# Altium schematic sheet CTR_MCU_Power.SchDoc: TMS320 Power
size A4; DrawnBy: Andrei Divinagracia; Revision: 0A; SheetNumber: 5; SheetTotal: 10
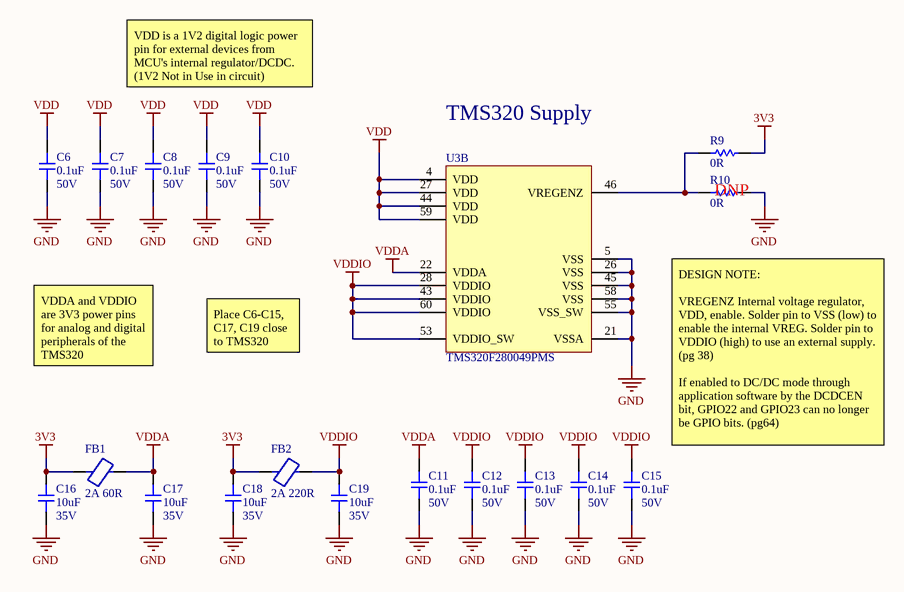
[diagram p0: CTR_MCU_Power.SchDoc]

## Parts
C6  Capacitance: 0.1uF  Voltage Rating: 50V  [CAP-0603]  (hidden comment: 0603-0.1uF-50V)
C7  Capacitance: 0.1uF  Voltage Rating: 50V  [CAP-0603]  (hidden comment: 0603-0.1uF-50V)
C8  Capacitance: 0.1uF  Voltage Rating: 50V  [CAP-0603]  (hidden comment: 0603-0.1uF-50V)
C9  Capacitance: 0.1uF  Voltage Rating: 50V  [CAP-0603]  (hidden comment: 0603-0.1uF-50V)
C10  Capacitance: 0.1uF  Voltage Rating: 50V  [CAP-0603]  (hidden comment: 0603-0.1uF-50V)
C11  Capacitance: 0.1uF  Voltage Rating: 50V  [CAP-0603]  (hidden comment: 0603-0.1uF-50V)
C12  Capacitance: 0.1uF  Voltage Rating: 50V  [CAP-0603]  (hidden comment: 0603-0.1uF-50V)
C13  Capacitance: 0.1uF  Voltage Rating: 50V  [CAP-0603]  (hidden comment: 0603-0.1uF-50V)
C14  Capacitance: 0.1uF  Voltage Rating: 50V  [CAP-0603]  (hidden comment: 0603-0.1uF-50V)
C15  Capacitance: 0.1uF  Voltage Rating: 50V  [CAP-0603]  (hidden comment: 0603-0.1uF-50V)
C16  Capacitance: 10uF  Voltage Rating: 35V  [CAP-0603]  (hidden comment: 0603-10uF-35V)
C17  Capacitance: 10uF  Voltage Rating: 35V  [CAP-0603]  (hidden comment: 0603-10uF-35V)
C18  Capacitance: 10uF  Voltage Rating: 35V  [CAP-0603]  (hidden comment: 0603-10uF-35V)
C19  Capacitance: 10uF  Voltage Rating: 35V  [CAP-0603]  (hidden comment: 0603-10uF-35V)
FB1  2A 60R  [FB-0805]
FB2  2A 220R  [FB-0805]
R9  0R  [RES-0603]
R10  0R  [RES-0603]
U3  TMS320F280049PMS  [64QFP]  (part B of 5)

## Nets
3V3: C16.2 C18.2 FB1.1 FB2.1 R9.2
GND: C6.1 C7.1 C8.1 C9.1 C10.1 C11.1 C12.1 C13.1 C14.1 C15.1 C16.1 C17.1 C18.1 C19.1 R10.2 U3.5(VSS) U3.21(VSSA) U3.26(VSS) U3.45(VSS) U3.55(VSS_SW) U3.58(VSS)
VDD: C6.2 C7.2 C8.2 C9.2 C10.2 U3.4(VDD) U3.27(VDD) U3.44(VDD) U3.59(VDD)
VDDA: C11.2 C17.2 FB1.2 U3.22(VDDA)
VDDIO: C12.2 C13.2 C14.2 C15.2 C19.2 FB2.2 U3.28(VDDIO) U3.43(VDDIO) U3.53(VDDIO_SW) U3.60(VDDIO)
NetR9_1: R9.1 R10.1 U3.46(VREGENZ)

## Notes on the sheet
- VDD is a 1V2 digital logic power pin for external devices from MCU's internal regulator/DCDC.
  (1V2 Not in Use in circuit)
- (near U3) TMS320 Supply
- (near R10) DNP
- VDDA and VDDIO are 3V3 power pins for analog and digital peripherals of the TMS320
- Place C6-C15, C17, C19 close to TMS320
- DESIGN NOTE:
  VREGENZ Internal voltage regulator, VDD, enable. Solder pin to VSS (low) to enable the internal VREG. Solder pin to VDDIO (high) to use an external supply. (pg 38)
  If enabled to DC/DC mode through application software by the DCDCEN bit, GPIO22 and GPIO23 can no longer be GPIO bits. (pg64)

## Library data of the parts
C6-C15 = 0603-0.1uF-50V: CAP CER 0.1UF 50V X7R 0603; Manufacturer: Kyocera AVX; Manufacturer Part Number: 06035C104JAT4A; Supplier 1: Digi-Key; Stock 1: 71529; Pricing 1: 1=0.1, 10=0.07, 50=0.0382, 100=0.0313, 500=0.02234, 1000=0.01755, 2500=0.01596, 5000=0.01468 (USD); RoHS Compliant: Yes; ComponentLink1URL: http://datasheets.avx.com/X7RDielectric.pdf?src-supplier=Digi-Key; ComponentLink1Description: http://datasheets.avx.com/X7RDielectric.pdf?src-supplier=Digi-Key; Supplier Part Number 1: 478-12459-1-ND
C16-C19 = 0603-10uF-35V: CAP CER 10UF 35V X5R 0603; Manufacturer: Murata; Manufacturer Part Number: GRM188R6YA106MA73D; Tolerance: 20%; Supplier 1: Digi-Key; Stock 1: 133; Pricing 1: 1=0.45, 10=0.315, 50=0.2202, 100=0.1887, 500=0.14154, 1000=0.11952 (USD); Mount: Surface Mount; Case/Package: 0603; Case Code (Metric): 1608; Case Code (Imperial): 0603; Min Operating Temperature: -55°C; Max Operating Temperature: 85°C; Packaging: Tape and Reel; Voltage Rating (DC): 35V; Dielectric: X5R; Length: 0.063inch; Width: 0.031inch; Thickness: 0.039inch; RoHS Compliant: Yes; ComponentLink1URL: http://search.murata.co.jp/Ceramy/image/img/A01X/G101/ENG/GRM188R6YA106MA73-01.pdf?src-supplier=Future+Electronics; ComponentLink1Description: http://search.murata.co.jp/Ceramy/image/img/A01X/G101/ENG/GRM188R6YA106MA73-01.pdf?src-supplier=Future+Electronics; ComponentLink2URL: http://search.murata.co.jp/Ceramy/image/img/A01X/G101/ENG/GRM188R6YA106MA73-01.pdf?src-supplier=Digi-Key; ComponentLink2Description: http://search.murata.co.jp/Ceramy/image/img/A01X/G101/ENG/GRM188R6YA106MA73-01.pdf?src-supplier=Digi-Key; ComponentLink3URL: https://www.murata.com/~/media/webrenewal/support/library/catalog/products/capacitor/mlcc/c02e.ashx?la=en-us&src-supplier=Digi-Key; ComponentLink3Description: https://www.murata.com/~/media/webrenewal/support/library/catalog/products/capacitor/mlcc/c02e.ashx?la=en-us&src-supplier=Digi-Key; ComponentLink4URL: http://search.murata.co.jp/Ceramy/image/img/A01X/G101/ENG/GRM188R6YA106MA73-01.pdf?src-supplier=Mouser; ComponentLink4Description: http://search.murata.co.jp/Ceramy/image/img/A01X/G101/ENG/GRM188R6YA106MA73-01.pdf?src-supplier=Mouser; ComponentLink5URL: http://search.murata.co.jp/Ceramy/image/img/A01X/G101/ENG/GRM188R6YA106MA73-01.pdf?src-supplier=TTI; ComponentLink5Description: http://search.murata.co.jp/Ceramy/image/img/A01X/G101/ENG/GRM188R6YA106MA73-01.pdf?src-supplier=TTI; Supplier Part Number 1: 490-13248-1-ND
FB1 = BKP2125HS600-T: FERRITE BEAD 60 OHM 0805 1LN; Manufacturer: Taiyo Yuden; Tolerance: 25%; Resistance: 25mR; Max Current Rating: 3A; Number of Lines: 1; Test Frequency: 100MHz; Shielding: Unshielded; Supplier 1: Digi-Key; Manufacturer Part Number: BKP2125HS600-T; Stock 1: 471; Pricing 1: 1=0.11, 10=0.086, 25=0.0768, 50=0.0564, 100=0.0487, 250=0.03848 (USD); Mount: Surface Mount; Case/Package: 0805; Number of Pins: 2; Core Material: Ferrite; Case Code (Metric): 2125; Case Code (Imperial): 0805; Min Operating Temperature: -55°C; Max Operating Temperature: 85°C; Packaging: Tape and Reel; Impedance: 60R; Package Quantity: 1; DC Resistance (DCR): 25mR; Max DC Current: 3A; Termination: SMD/SMT; Series: BK; Length: 2.3mm; Width: 0.049inch; Height: 1.05mm; Depth: 1.45mm; REACH SVHC: Unknown; Lead Free: Lead Free; Halogen Free: Halogen Free; RoHS Compliant: Yes; ComponentLink1URL: http://ds.yuden.co.jp/TYCOMPAS/ut/detail.do?productNo=BKP2125HS600-T&fileName=BKP2125HS600-T_SS&mode=specSheetDownload&src-supplier=Digi-Key; ComponentLink1Description: http://ds.yuden.co.jp/TYCOMPAS/ut/detail.do?productNo=BKP2125HS600-T&fileName=BKP2125HS600-T_SS&mode=specSheetDownload&src-supplier=Digi-Key; Supplier Part Number 1: 587-1932-1-ND
FB2 = BLM21PG221SN1D: FERRITE BEAD 220 OHM 0805 1LN; Manufacturer: Murata; Material: Ferrite,Steel; Tolerance: 25%; Number of Lines: 1; DC Resistance (DCR): 45mR; Test Frequency: 100MHz; Shielding: Unshielded; Supplier 1: Digi-Key; Manufacturer Part Number: BLM21PG221SN1D; Stock 1: 73275; Pricing 1: 1=0.1, 10=0.081, 25=0.074, 50=0.0666, 100=0.0488, 250=0.03552, 500=0.03256, 1000=0.02812 (USD); Case/Package: 0805; Number of Pins: 2; Core Material: Ferrite; Case Code (Metric): 2012; Case Code (Imperial): 0805; Contact Plating: Tin,Matte; Min Operating Temperature: -55°C; Max Operating Temperature: 125°C; Package Quantity: 1; Impedance: 220R; Max Current Rating: 2A; Packaging: Tape and Reel; Current Rating: 2A; Max DC Current: 2A; Termination: SMD/SMT; DC Current: 2A; Frequency: 100MHz; Number of Circuits: 1; Current: 2A; Series: BLM21P; DC Resistance-Max: 45mR; Length: 2mm; Width: 1.25mm; Height: 0.85mm; Depth: 1.25mm; Radiation Hardening: No; REACH SVHC: No SVHC; Military Standard: Not; Lead Free: Lead Free; RoHS Compliant: Yes; ComponentLink1URL: http://www.farnell.com/datasheets/1914683.pdf?src-supplier=Element14; ComponentLink1Description: http://www.farnell.com/datasheets/1914683.pdf?src-supplier=Element14; ComponentLink2URL: https://www.distrelec.biz/Web/Downloads/ta/_e/anBLM21P_Data_E.pdf?mime=application%2Fpdf&src-supplier=Distrelec; ComponentLink2Description: https://www.distrelec.biz/Web/Downloads/ta/_e/anBLM21P_Data_E.pdf?mime=application%2Fpdf&src-supplier=Distrelec; ComponentLink3URL: http://www.jameco.com/Jameco/Products/ProdDS/1845321.pdf?src-supplier=Jameco; ComponentLink3Description: http://www.jameco.com/Jameco/Products/ProdDS/1845321.pdf?src-supplier=Jameco; ComponentLink4URL: https://www.murata.com/en-us/products/productdata/8796738977822/ENFA0005.pdf?src-supplier=Digi-Key; ComponentLink4Description: https://www.murata.com/en-us/products/productdata/8796738977822/ENFA0005.pdf?src-supplier=Digi-Key; ComponentLink5URL: http://uk.rs-online.com/webdocs/1388/0900766b813885e8.pdf?src-supplier=RSComponents; ComponentLink5Description: http://uk.rs-online.com/webdocs/1388/0900766b813885e8.pdf?src-supplier=RSComponents; ComponentLink6URL: http://search.murata.co.jp/Ceramy/image/img/PDF/ENG/L0110S0100BLM21P.pdf?src-supplier=Avnet; ComponentLink6Description: http://search.murata.co.jp/Ceramy/image/img/PDF/ENG/L0110S0100BLM21P.pdf?src-supplier=Avnet; ComponentLink7URL: http://search.murata.co.jp/Ceramy/image/img/PDF/ENG/L0110S0100BLM21P.pdf?src-supplier=Future+Electronics; ComponentLink7Description: http://search.murata.co.jp/Ceramy/image/img/PDF/ENG/L0110S0100BLM21P.pdf?src-supplier=Future+Electronics; ComponentLink8URL: http://www.produktinfo.conrad.com/datenblaetter/425000-449999/442529-da-01-en-CHIP_DROSSEL_0805_220R_2000MA_2_0X1_25MM.pdf?src-supplier=Conrad; ComponentLink8Description: http://www.produktinfo.conrad.com/datenblaetter/425000-449999/442529-da-01-en-CHIP_DROSSEL_0805_220R_2000MA_2_0X1_25MM.pdf?src-supplier=Conrad; Supplier Part Number 1: 490-1054-1-ND
R9 R10 = 0603-0R: RES SMD 0 OHM JUMPER 1/10W 0603; Manufacturer: Yageo; Manufacturer Part Number: RC0603JR-070RL; Resistance: 0mR; Tolerance: 1%; Voltage Rating: 50V; Power Rating: 100mW; Temperature Coefficient: 200ppm/°C; Supplier 1: Digi-Key; Stock 1: 25658294; Pricing 1: 1=0.1, 10=0.019, 25=0.0136, 50=0.0104, 100=0.0077, 250=0.00588, 500=0.00472, 1000=0.00347 (USD); Case/Package: 0603; Number of Pins: 2; Case Code (Imperial): 0603; Case Code (Metric): 1608; Contact Plating: Tin,Matte; Min Operating Temperature: -55°C; Max Operating Temperature: 155°C; Package Quantity: 5000; Packaging: Tape and Reel; Voltage Rating (DC): 50V; Termination: SMD/SMT; Composition: Thick Film; Military Standard: Not; Length: 1.6mm; Height: 0.45mm; Width: 0.8mm; Depth: 0.8mm; Radiation Hardening: No; REACH SVHC: No SVHC; Lead Free: Lead Free; ComponentLink1URL: http://www.farnell.com/datasheets/2167052.pdf?src-supplier=Element14; ComponentLink1Description: http://www.farnell.com/datasheets/2167052.pdf?src-supplier=Element14; ComponentLink2URL: https://www.verical.com/server-webapp/html/getDatasheet?partID=329462&src-supplier=Verical; ComponentLink2Description: https://www.verical.com/server-webapp/html/getDatasheet?partID=329462&src-supplier=Verical; ComponentLink3URL: http://www.yageo.com/documents/recent/PYu-RC_Group_51_RoHS_L_9.pdf?src-supplier=Mouser; ComponentLink3Description: http://www.yageo.com/documents/recent/PYu-RC_Group_51_RoHS_L_9.pdf?src-supplier=Mouser; ComponentLink4URL: http://www.farnell.com/datasheets/443971.pdf?src-supplier=Element14; ComponentLink4Description: http://www.farnell.com/datasheets/443971.pdf?src-supplier=Element14; ComponentLink5URL: http://documents.rs-components.com/techlib://itc_doclist_GB.htm?stockno=6515918&src-supplier=RSComponents; ComponentLink5Description: http://documents.rs-components.com/techlib://itc_doclist_GB.htm?stockno=6515918&src-supplier=RSComponents; Supplier Part Number 1: 311-0.0GRCT-ND
U3 = TMS320F280049: IC MCU 32BIT 256KB FLASH 64LQFP; Manufacturer: Texas Instruments; Manufacturer Part Number: F280049CPMS; Number of UART Channels: 2; Interface: I2C,SPI,UART,USART,SCI; Peripherals: Brown-out Detect/Reset,POR,PWM,WDT; Frequency: 100MHz; Number of I/Os: 26; Oscillator Type: Internal; Supplier 1: Mouser; Stock 1: 0; Pricing 1: 1=10.7, 10=9.68, 50=9.23, 100=8.01, 1000=6.07, 10000=6.07 (USD); Case/Package: LQFP; Min Operating Temperature: -40°C; Max Operating Temperature: 125°C; Memory Type: FLASH; Packaging: Tray; Memory Size: 256KB; RoHS Compliant: Yes; ComponentLink1URL: http://www.ti.com/lit/pdf/sprui33?src-supplier=Digi-Key; ComponentLink1Description: http://www.ti.com/lit/pdf/sprui33?src-supplier=Digi-Key; Supplier Part Number 1: 595-F280049CPMS